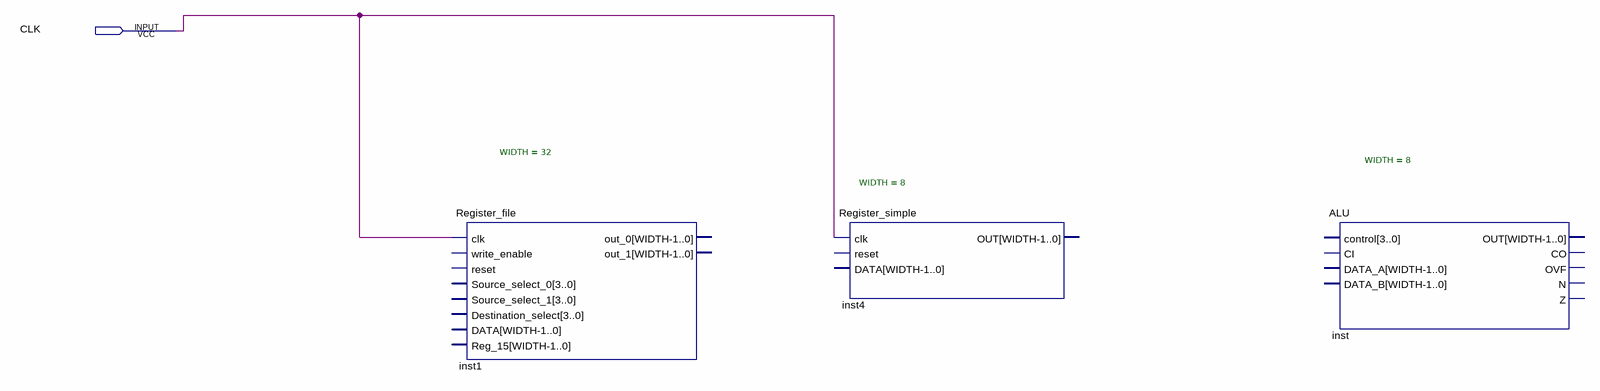
[diagram p0: schematic sheet]
// Quartus schematic datapath_schematic.bdf as structural Verilog: 3 symbols, 1 pins
module datapath_schematic (
  input  CLK
);

  Register_file #(.WIDTH(32)) inst1 (.clk(CLK));  // open: write_enable, reset, Source_select_0, Source_select_1, Destination_select, DATA, Reg_15, out_0, out_1
  Register_simple #(.WIDTH(8)) inst4 (.clk(CLK));  // open: reset, DATA, OUT
  ALU #(.WIDTH(8)) inst ();  // open: control, CI, DATA_A, DATA_B, OUT, CO, OVF, N, Z
endmodule
